# EAGLE design PCB_Gabri1.1.1 (EAGLE 8.6.3)
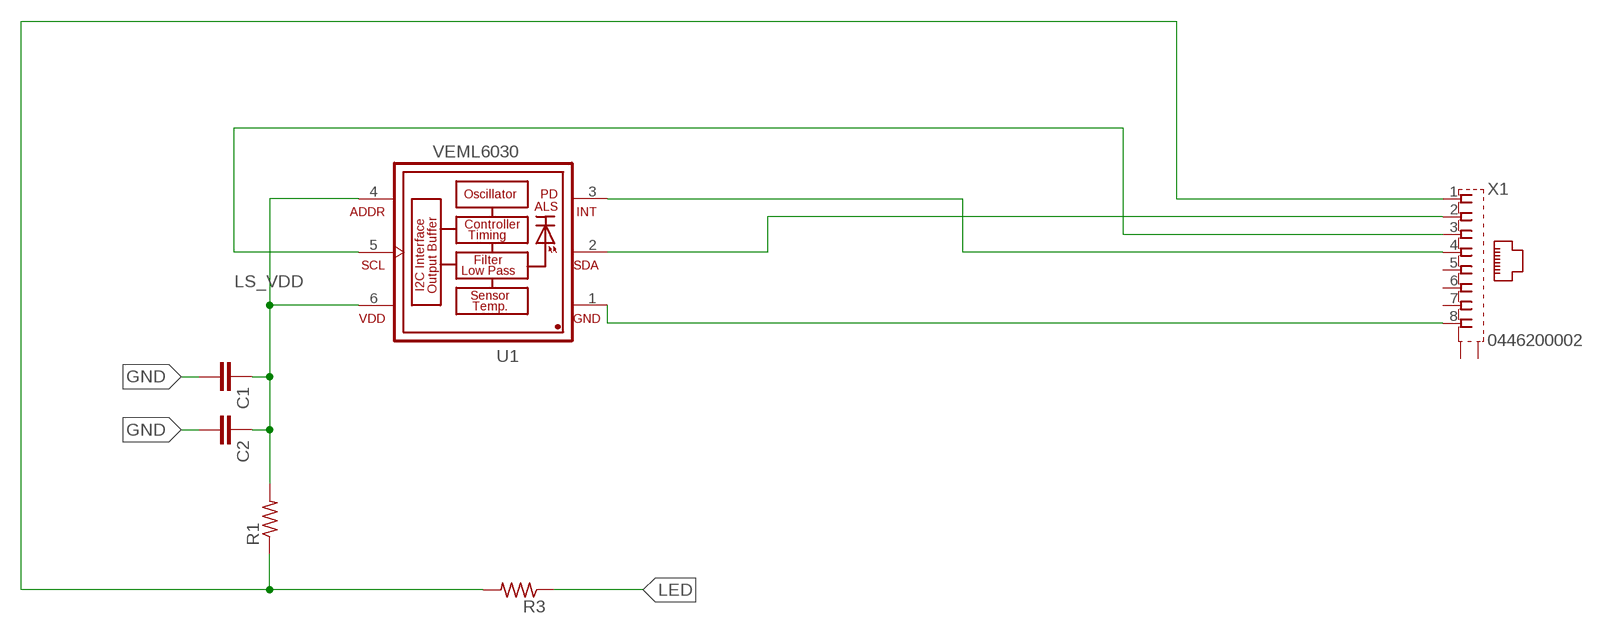
[diagram p0: schematic, sheet 1]

## Parts
C1  C-EU025-024X044  [C025-024X044]
C2  C-EU025-024X044  [C025-024X044]
R1  R-US_R0805  [R0805]
R3  R-US_R0805  [R0805]
U1  VEML6030  [VISHAY_VEML6030_2X2X0.87]
X1  0446200002  [0446200002]

## Nets
3V3: R1.1 R3.2 X1.1
GND: C1.2 C2.2 U1.1(GND) X1.8
INT: U1.3(INT) X1.4
LED: R3.1
LS_VDD: C1.1 C2.1 R1.2 U1.4(ADDR) U1.6(VDD)
SCL: U1.5(SCL) X1.3
SDA: U1.2(SDA) X1.2
Unconnected: X1.5 X1.6 X1.7 X1.S@1(S1) X1.S@2(S2)

## Library data of the parts
C1 C2 = resistor:C-EU: CAPACITOR, European symbol
R1 R3 = resistor:R-US_: RESISTOR, American symbol
U1 = VEML6030:VEML6030: VEML6030 High Accuracy Ambient Light Sensor with I2C Interface: VEML6030 is a high accuracy ambient light digital 16-bit resolution sensor in a miniature transparent 2 mm x 2 mm package. It includes a high sensitive photodiode, a low noise amplifier, a 16-bit A/D converter and supports an easy to use I2C bus communication interface and additional interrupt feature. The ambient light result is as digital value available. Device Model created 15.06.2016 by Johannes Kolb - Vishay Semiconductor GmbH; AVAILABILITY: Unavailable; DESCRIPTION: VEML6030 Series 2 x 2 x 0.85 mm 50 mW I2C High Accuracy Ambient Light Sensor; MF: Vishay; MP: VEML6030; PACKAGE: SMD-6 Vishay; PRICE: None
X1 = 0446200002:0446200002: RJ-45 INVERTED MODULAR JACK ASSEMBLY WITH RJ-11 KEEPOUT FEATURE Source: Data sheet <http://www.farnell.com/datasheets/73207.pdf> MOLEX 0446200002 BUCHSE, RJ45, GESCHIRMT Source: Farnell <http://de.farnell.com/molex/0446200002/buchse-rj45-geschirmt/dp/9251910?ost=9251910>; AVAILABILITY: Unavailable; DESCRIPTION: Conn RJ-45 RCP 8 POS 2.04mm Solder RA Thru-Hole 8 Terminal 1 Port Tray Cat 3; MF: Molex, LLC; MP: 0446200002; PACKAGE: None; PRICE: None

## Board
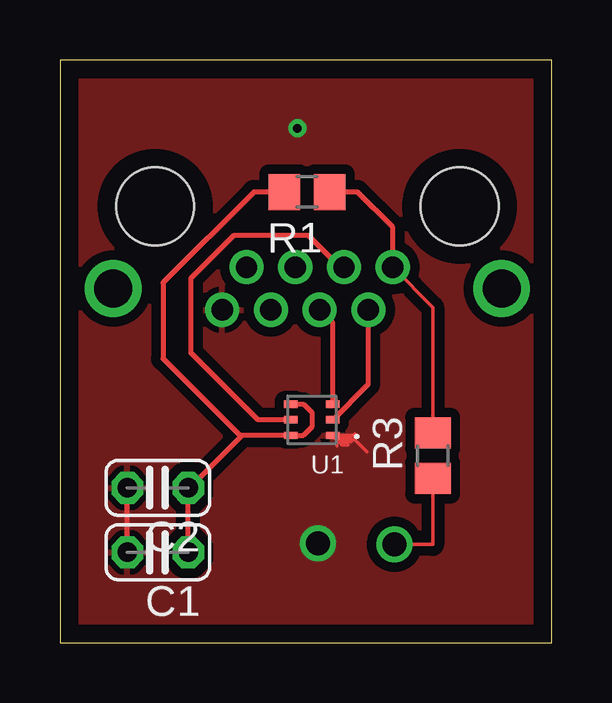
[diagram p1: board, top side]
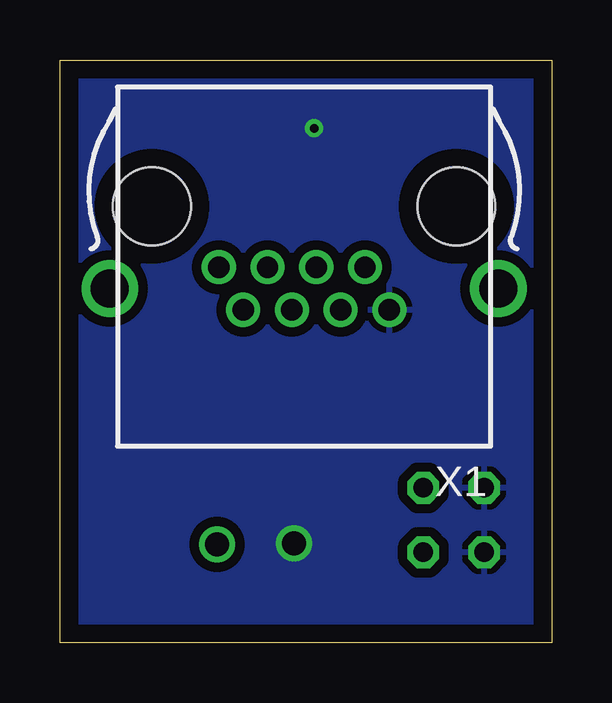
[diagram p2: board, bottom side, seen from below]

Size 20.5 x 24.3 mm. Coordinates in mm from the lower left corner, seen from the top.
Outline: 0,0 20.5,0 20.5,24.3 0,24.3 0,0
Copper layers (1*16): Top 0.035mm / dielectric 1.5mm / Bottom 0.035mm
Design rules "default *": minimum track width 10mil, minimum drill 0.5mm, track to track 0.4mm, track to pad 0.4mm, pad to pad 1mm, via to via 1mm, smd to smd 0.8mm, copper to edge 30mil, drill to drill 8mil, minimum pad ring 10mil, minimum via ring 8mil, stop-mask expansion 4mil, vias tented up to drill 0mil, thermal gap 10mil

### Footprints (pad centres in the part's own frame; a part is rotated, then mirrored left to right if it is on the bottom)
C025-024X044 = drill 0.813 octagon: 1 -1.27,0; 2 1.27,0
R0805 = smd 1.3 x 1.5: 1 -0.95,0; 2 0.95,0
VISHAY_VEML6030_2X2X0.87 = smd 0.55 x 0.3: 1 -0.875,0.65; 2 -0.875,0; 3 -0.875,-0.65; 4 0.875,-0.65; 5 0.875,0; 6 0.875,0.65
0446200002 = drill 0.889 pad 1.422: 1 3.556,2.54; 2 2.54,4.318; 3 1.524,2.54; 4 0.508,4.318; 5 -0.508,2.54; 6 -1.524,4.318; 7 -2.54,2.54; 8 -3.556,4.318 | drill 1.575 pad 2.286: S@1 -8.103,3.429; S@2 8.103,3.429 | hole 3.251: 6.35,0; -6.35,0

### Placement (x,y rotation side)
C1  4.08,3.77 180 top
C2  4.08,6.46 180 top
R1  10.3,18.8 180 top
R3  15.55,7.8 90 top
U1  10.5,9.3 180 top
X1  10.32,18.2 180 bottom

### Tracks (layer width: path | path; a pad name or v marks a point on that pad's centre or on a via)
3V3
  Top 0.152: X1.1 15.55,13.99 R3.2
  Top 0.203: X1.1 13.88,17.32 12.4,18.8 R1.1
GND  (via drill 0.35, 1)
  Top 0.152: 12.8,7.95 12.3,8.45 12.3,8.7 12.25,8.65 11.4,8.65 | U1.1 11.4,8.65 | 11.45,8.55 11.75,8.25 12,8.25 11.7,8.55 | 11.7,8.55 11.65,8.55 | 11.7,8.55 12.1,8.55 12.2,8.45 12.15,8.4 11.75,8.4 11.6,8.55 11.55,8.5 | 11.55,8.2 11.55,8.5 | 11.55,8.5 11.4,8.65
  Top 0.203: C1.2 C2.2
  other vias: 10.75,4.15 9.9,21.45
  pour Top: 0,24.3 20.55,24.3 20.55,0 0,0
  pour Bottom: 0,24.3 20.55,24.3 20.55,0 0,0
INT
  Top 0.203: U1.3 11.38,13.33 X1.4
LED  (via drill 1)
  Top 0.152: R3.1 15.55,4.1 v13.95,4.1
LS_VDD
  Top 0.203: C1.1 5.35,6.4 | 5.35,6.4 C2.1 | U1.4 10.15,9.95 10.5,9.6 10.5,9 10.15,8.65 U1.6 7.6,8.65 | 7.6,8.65 5.35,6.4 | 7.6,8.65 7.5,8.65 4.3,11.85 4.3,15.01 8.09,18.8 R1.2
SCL
  Top 0.203: X1.3 11.67,15.66 10.36,16.97 7.24,16.97 5.45,15.19 5.45,12.1 8.25,9.3 U1.5
SDA
  Top 0.203: U1.2 12.86,10.78 X1.2